# EAGLE board amyboard-v1.1dpwe (EAGLE 9.6.2)
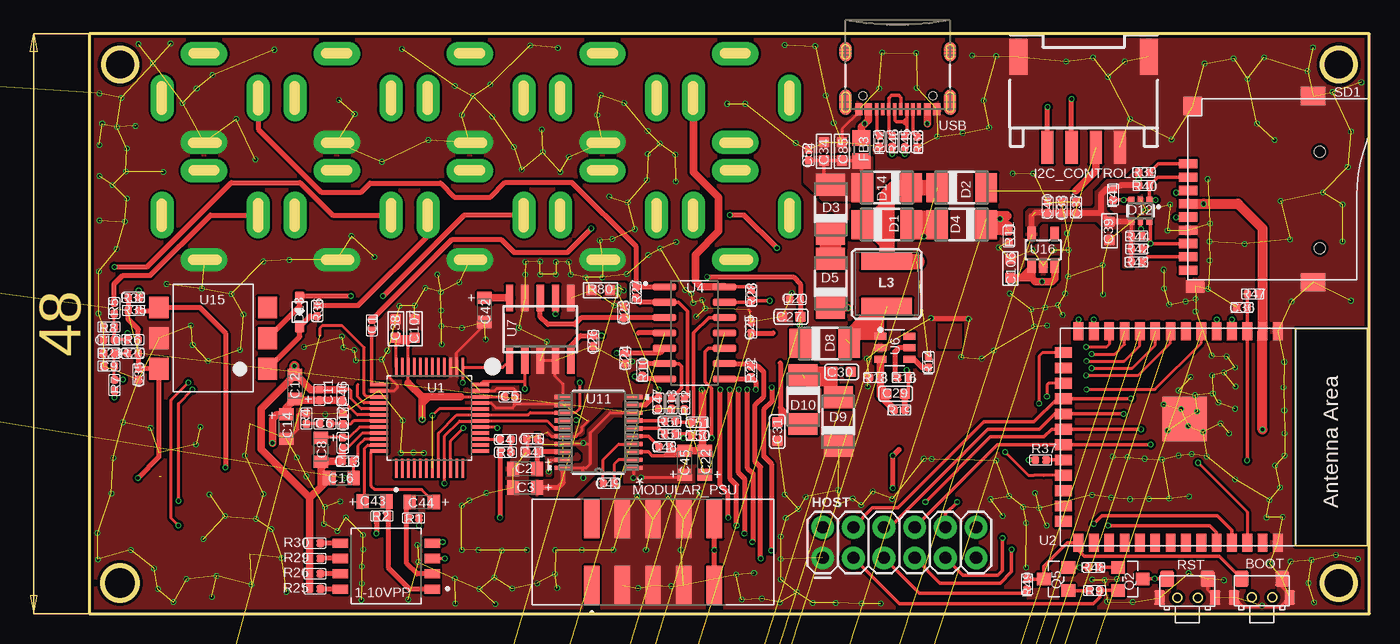
[diagram p2: board, top side]
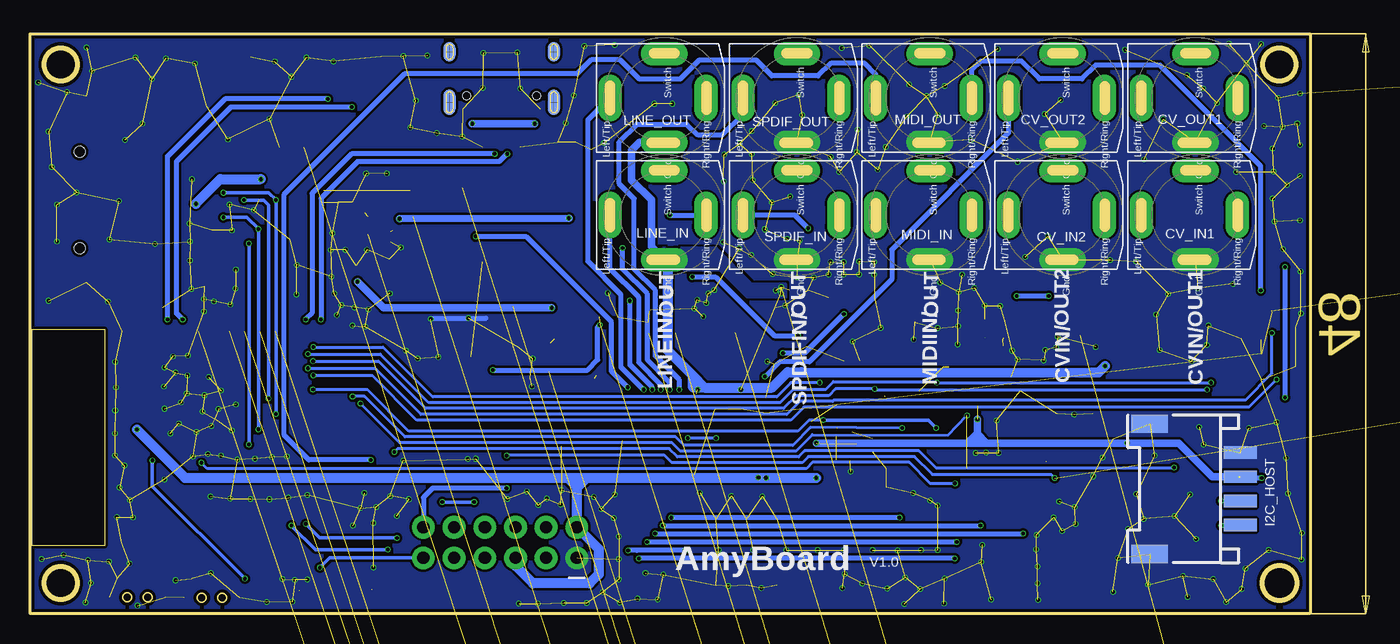
[diagram p3: board, bottom side, seen from below]

Size 106 x 48 mm. Coordinates in mm from the lower left corner, seen from the top.
Outline: 0,0 106,0 106,48 0,48 0,0
Outline: circle at 2.54,45.47 radius 1.37
Outline: circle at 2.54,2.54 radius 1.44
Outline: circle at 103.45,2.54 radius 1.37
Outline: circle at 103.45,45.47 radius 1.37
Copper layers (1*16): Top 0.035mm / dielectric 1.5mm / Bottom 0.035mm
Design rules "default": minimum track width 6mil, minimum drill 0.3mm, track to track 8mil, track to pad 8mil, pad to pad 8mil, via to via 8mil, smd to smd 0mil, copper to edge 10mil, drill to drill 8mil, minimum pad ring 3mil, minimum via ring 3mil, stop-mask expansion 4mil, vias tented up to drill 0mil, thermal gap 0mil
Net classes: 0 default: width 0.152 mm, drill 0.305 mm, clearance 0.152 mm

## Footprints (pad centres in the part's own frame; a part is rotated, then mirrored left to right if it is on the bottom)
SW_218-4LPSTR = smd 1.27 x 0.76: 1 -3.81,1.905; 2 -3.81,0.635; 3 -3.81,-0.635; 4 -3.81,-1.905; 5 3.81,-1.905; 6 3.81,-0.635; 7 3.81,0.635; 8 3.81,1.905
2*4*3.5MM = smd 1.15 x 1.3: 1 -1.675,0; 2 1.675,0 | smd 0.9 x 1.2: 3 2.3,1.55; 4 -2.3,1.55
DISCRETE_C0402 = smd 0.635 x 0.635: 1 -0.445,0; 2 0.445,0
SMC_Z = smd 1 x 1.2: + -1,0; - 1,0
C0603 = smd 0.889 x 0.889: 1 0,0.762; 2 0,-0.762
DISCRETE_C0603 = smd 0.889 x 0.889: 1 -0.762,0; 2 0.762,0
0603 = smd 0.889 x 0.889: 1 -0.762,0; 2 0.762,0
NV-PJ3410_SOCKET = drill 0.33 pad 1.93 long: GND 3.69,0; LEFT/TIP 0,-4.49; RIGHT/RING 0,3.459; SWITCH -3.674,0
DO-214AC = smd 1.8 x 2.4: A 2.025,0; C -2.025,0
SOT363 = smd 0.5 x 0.5: 1 -0.75,-0.9; 3 0.75,-0.9; 4 0.75,0.9; 6 -0.75,0.9 | smd 0.4 x 0.5: 2 0,-0.9; 5 0,0.9
SOD323 = smd 1 x 0.8: + -1.2,0; - 1.2,0
R0805 = smd 1.3 x 1.5: 1 -0.95,0; 2 0.95,0
2X6 = drill 1.016 pad 1.88: 1 0,0; 2 0,2.54; 3 2.54,0; 4 2.54,2.54; 5 5.08,0; 6 5.08,2.54; 7 7.62,0; 8 7.62,2.54; 9 10.16,0; 10 10.16,2.54; 11 12.7,0; 12 12.7,2.54
HW4-SMD-2.0-90D = smd 1.01 x 2.74: 1 -3,-0.1; 2 -1,-0.1; 3 1,-0.1; 4 3,-0.1 | smd 1.5 x 3: SS1 -5.4,7.4; SS2 5.4,7.4
CR54 = smd 4.2 x 1.4: P$1 0,1.85; P$2 0,-1.85
SOT25 = smd 0.55 x 1.2: 1 -0.95,-1.3; 2 0,-1.3; 3 0.95,-1.3; 4 0.95,1.3; 5 -0.95,1.3
SOT23-5 = smd 0.69 x 1.2: 1 -0.95,-1.3; 2 0,-1.3; 3 0.95,-1.3; 4 0.95,1.3; 5 -0.95,1.3
AMPHENOL_52601-G10-8LF = smd 1.27 x 3.18: 01 -5.08,-2.73; 02 -5.08,2.73; 03 -2.54,-2.73; 04 -2.54,2.73; 05 0,-2.73; 06 0,2.73; 07 2.54,-2.73; 08 2.54,2.73; 09 5.08,-2.73; 10 5.08,2.73
PW20_TEX = smd 1.473 x 0.356: 1 -2.921,2.925; 2 -2.921,2.275; 3 -2.921,1.625; 4 -2.921,0.975; 5 -2.921,0.325; 6 -2.921,-0.325; 7 -2.921,-0.975; 8 -2.921,-1.625; 9 -2.921,-2.275; 10 -2.921,-2.925; 11 2.921,-2.925; 12 2.921,-2.275; 13 2.921,-1.625; 14 2.921,-0.975; 15 2.921,-0.325; 16 2.921,0.325; 17 2.921,0.975; 18 2.921,1.625; 19 2.921,2.275; 20 2.921,2.925
SOT23 = smd 1.016 x 1.143: 1 -0.95,-1.016; 2 0.95,-1.016; 3 0,1.016
SOT23-3 = smd 0.8 x 0.9: 1 -0.95,-1; 2 0.95,-1; 3 0,1.1
DISCRETE_R0402 = smd 0.635 x 0.635: 1 -0.445,0; 2 0.445,0
DISCRETE_R0603 = smd 0.889 x 0.889: 1 -0.762,0; 2 0.762,0
9P-SMD-W/-RING = smd 1.524 x 0.762: 1 0,4.4; 2 0,3.3; 3 0,2.2; 4 0,1.1; 5 0,0; 6 0,-1.1; 7 0,-2.2; 8 0,-3.3; 9 0,-4.4 | smd 1.524 x 1.016: G1 0.6,-5.746 | smd 2.032 x 1.524: G2 10.373,-5.4; G3 10.373,10 | smd 1.524 x 1.524: G4 0.392,9.181 | hole 0.889: 10.9,-2.6; 10.9,5.4
SM77H = smd 1.6 x 1.5: 1 -2.55,-1.9; 2 2.55,-1.9; 3 2.55,1.9; 4 -2.55,1.9
QFP50P900X900X160-48N = smd 1.56 x 0.28: 1 -4.18,2.75; 2 -4.18,2.25; 3 -4.18,1.75; 4 -4.18,1.25; 5 -4.18,0.75; 6 -4.18,0.25; 7 -4.18,-0.25; 8 -4.18,-0.75; 9 -4.18,-1.25; 10 -4.18,-1.75; 11 -4.18,-2.25; 12 -4.18,-2.75; 25 4.18,-2.75; 26 4.18,-2.25; 27 4.18,-1.75; 28 4.18,-1.25; 29 4.18,-0.75; 30 4.18,-0.25; 31 4.18,0.25; 32 4.18,0.75; 33 4.18,1.25; 34 4.18,1.75; 35 4.18,2.25; 36 4.18,2.75 | smd 0.28 x 1.56: 13 -2.75,-4.18; 14 -2.25,-4.18; 15 -1.75,-4.18; 16 -1.25,-4.18; 17 -0.75,-4.18; 18 -0.25,-4.18; 19 0.25,-4.18; 20 0.75,-4.18; 21 1.25,-4.18; 22 1.75,-4.18; 23 2.25,-4.18; 24 2.75,-4.18; 37 2.75,4.18; 38 2.25,4.18; 39 1.75,4.18; 40 1.25,4.18; 41 0.75,4.18; 42 0.25,4.18; 43 -0.25,4.18; 44 -0.75,4.18; 45 -1.25,4.18; 46 -1.75,4.18; 47 -2.25,4.18; 48 -2.75,4.18
ESP32-­S2-­SOLO = smd 1.5 x 0.9: 1 -8.75,5.26; 2 -8.75,3.99; 3 -8.75,2.72; 4 -8.75,1.45; 5 -8.75,0.18; 6 -8.75,-1.09; 7 -8.75,-2.36; 8 -8.75,-3.63; 9 -8.75,-4.9; 10 -8.75,-6.17; 11 -8.75,-7.44; 12 -8.75,-8.71; 13 -8.75,-9.98; 14 -8.75,-11.25; 27 8.75,-11.25; 28 8.75,-9.98; 29 8.75,-8.71; 30 8.75,-7.44; 31 8.75,-6.17; 32 8.75,-4.9; 33 8.75,-3.63; 34 8.75,-2.36; 35 8.75,-1.09; 36 8.75,0.18; 37 8.75,1.45; 38 8.75,2.72; 39 8.75,3.99; 40 8.75,5.26 | smd 0.9 x 1.5: 15 -6.985,-12.5; 16 -5.715,-12.5; 17 -4.445,-12.5; 18 -3.175,-12.5; 19 -1.905,-12.5; 20 -0.635,-12.5; 21 0.635,-12.5; 22 1.905,-12.5; 23 3.175,-12.5; 24 4.445,-12.5; 25 5.715,-12.5; 26 6.985,-12.5 | smd 3.7 x 3.7: 41 -1.5,-2.46
SOIC127P600X175-14N = smd 1.97 x 0.6: 1 -2.475,3.81; 2 -2.475,2.54; 3 -2.475,1.27; 4 -2.475,0; 5 -2.475,-1.27; 6 -2.475,-2.54; 7 -2.475,-3.81; 8 2.475,-3.81; 9 2.475,-2.54; 10 2.475,-1.27; 11 2.475,0; 12 2.475,1.27; 13 2.475,2.54; 14 2.475,3.81
SOP50P490X110-10N = smd 1.47 x 0.28: 1 -2.15,1; 2 -2.15,0.5; 3 -2.15,0; 4 -2.15,-0.5; 5 -2.15,-1; 6 2.15,-1; 7 2.15,-0.5; 8 2.15,0; 9 2.15,0.5; 10 2.15,1
SOT-23-6 = smd 1 x 0.6: 1 -1.2,0.95; 2 -1.2,0; 3 -1.2,-0.95; 4 1.2,-0.95; 5 1.2,0; 6 1.2,0.95
SOIC-10 = smd 0.6 x 2.2: 1 -2.54,-2.6; 2 -1.27,-2.6; 3 0,-2.6; 4 1.27,-2.6; 5 2.54,-2.6; 6 2.54,2.6; 7 1.27,2.6; 8 0,2.6; 9 -1.27,2.6; 10 -2.54,2.6
SOP-6-2.54MM = smd 1.6 x 1.8: 1 -4.5,2.54; 2 -4.5,0; 3 -4.5,-2.54; 4 4.5,-2.54; 5 4.5,0; 6 4.5,2.54
USB-C-16P-5 = smd 0.3 x 1: A5 -1.25,-0.34; A6 -0.25,-0.34; A7 0.25,-0.34; A8 1.25,-0.34; B5 1.75,-0.34; B6 0.75,-0.34; B7 -0.75,-0.34; B8 -1.75,-0.34 | smd 0.6 x 1: GND -3.225,-0.34; GND2 3.225,-0.34; VBUS1 -2.45,-0.34; VBUS2 2.45,-0.34 | smd 1 x 2.1: SHLD1 -4.32,-0.915; SHLD2 4.32,-0.915 | smd 1 x 2.1 bottom: SHLD3 -4.32,-0.915; SHLD4 4.32,-0.915 | smd 1 x 1.6: SHLD5 -4.32,-5.095; SHLD8 4.32,-5.095 | smd 1 x 1.6 bottom: SHLD6 -4.32,-5.095; SHLD7 4.32,-5.095 | hole 0.65: -2.89,-1.445; 2.89,-1.445

## Placement (x,y rotation side)
1-10VPP  218-4LPSTR  [SW_218-4LPSTR]  24.59,3.94 180 top
BOOT  TS24CA  [2*4*3.5MM]  97.1,2.9 180 top
C1  100nF  [DISCRETE_C0402]  23.39,23.88 90 top
C2  10uF/10V/TAN  [SMC_Z]  36.09,11.99 180 top
C3  10uF/10V/TAN  [SMC_Z]  36.09,10.46 180 top
C4  100nF  [DISCRETE_C0402]  34.47,14.43 0 top
C5  100nF  [DISCRETE_C0402]  34.82,17.96 0 top
C6  68nF  [DISCRETE_C0402]  19.51,15.72 0 top
C7  100nF  [DISCRETE_C0402]  20.98,14.15 270 top
C8  10uF/10V/TAN  [SMC_Z]  19.18,13.56 270 top
C9  1nF  [DISCRETE_C0402]  1.63,20.5 180 top
C10  1nF  [DISCRETE_C0402]  1.63,22.68 180 top
C11  100nF  [DISCRETE_C0402]  19.05,18.11 90 top
C12  10uF/10V/TAN  [SMC_Z]  17.04,18.77 90 top
C13  100nF  [DISCRETE_C0402]  21.39,12.62 180 top
C14  10uF/10V/TAN  [SMC_Z]  16.31,15.49 270 top
C15  100nF  [DISCRETE_C0402]  36.68,14.48 180 top
C16  10uF/10V/TAN  [SMC_Z]  20.88,11.23 180 top
C17  4.7nF  [DISCRETE_C0402]  21.01,16.15 270 top
C20  100nF  [DISCRETE_C0402]  58.45,26.01 0 top
C21  1uF  [DISCRETE_C0402]  -292.89,-1094.18 0 top  (outside the outline)
C22  10uF/10V/TAN  [SMC_Z]  50.98,12.5 90 top
C23  100nF  [DISCRETE_C0402]  44.25,24.94 270 top
C24  100nF  [DISCRETE_C0402]  44.37,21.13 90 top
C25  100nF  [DISCRETE_C0402]  54.81,23.67 90 top
C26  100nF  [DISCRETE_C0402]  41.73,22.58 90 top
C27  22uF  [C0603]  58.12,24.59 270 top
C28  10uF  [DISCRETE_C0402]  -292.89,-1091.62 0 top  (outside the outline)
C29  22pF  [C0603]  66.78,18.21 270 top
C30  1uF  [C0603]  62.31,20.02 270 top
C31  10uF  [C0603]  56.97,15.09 180 top
C32  1uF  [DISCRETE_C0402]  -292.89,-1107.74 0 top  (outside the outline)
C33  100nF  [DISCRETE_C0402]  80.52,33.63 270 top
C34  10uF  [DISCRETE_C0603]  60.83,38.28 270 top
C35  100nF  [DISCRETE_C0402]  4.06,19.81 270 top
C36  100nF  [DISCRETE_C0402]  95.45,25.35 0 top
C37  100nF  [DISCRETE_C0402]  81.71,33.63 270 top
C38  10uF  [DISCRETE_C0603]  25.37,23.6 90 top
C39  10uF  [DISCRETE_C0603]  84.48,31.7 90 top
C40  100nF  [DISCRETE_C0402]  79.35,33.63 90 top
C41  100nF  [DISCRETE_C0402]  36.65,13.39 0 top
C42  10uF/10V/TAN  [SMC_Z]  32.72,25.15 270 top
C43  10uF/10V/TAN  [SMC_Z]  23.62,9.27 0 top
C44  10uF/10V/TAN  [SMC_Z]  27.53,9.25 180 top
C45  10uF/10V/TAN  [SMC_Z]  49.3,12.5 90 top
C46  100nF  [DISCRETE_C0402]  20.98,18.11 90 top
C47  100nF  [DISCRETE_C0402]  47.14,17.4 90 top
C48  2.2uF  [DISCRETE_C0402]  47.62,13.82 180 top
C49  2.2uF  [DISCRETE_C0402]  43,10.79 180 top
C50  2.2nF  [DISCRETE_C0402]  50.34,14.76 180 top
C51  2.2nF  [DISCRETE_C0402]  50.34,15.85 180 top
C52  100nF  [DISCRETE_C0402]  59.56,37.97 270 top
C53  1uF  [DISCRETE_C0402]  -292.89,-1113.64 0 top  (outside the outline)
C54  1uF  [DISCRETE_C0402]  -292.89,62.23 0 top  (outside the outline)
C55  1uF  [DISCRETE_C0402]  -292.89,64.8 0 top  (outside the outline)
C56  10uF  [C0603]  -299.9,-1121.79 0 top  (outside the outline)
C85  10uF  [DISCRETE_C0603]  62.33,38.28 270 top
C106  4.7uF/16V  [0603]  76.28,28.57 90 top
C107  10uF  [0603]  26.92,23.6 90 top
CV_IN1  NV-PJ3410_STEREO  [NV-PJ3410_SOCKET]  9.5,33 270 bottom
CV_IN2  NV-PJ3410_STEREO  [NV-PJ3410_SOCKET]  20.5,33 270 bottom
CV_OUT1  NV-PJ3410_STEREO  [NV-PJ3410_SOCKET]  9.5,42.7 270 bottom
CV_OUT2  NV-PJ3410_STEREO  [NV-PJ3410_SOCKET]  20.5,42.7 270 bottom
D1  SS34  [DO-214AC]  66.04,32.21 0 top
D2  SS34  [DO-214AC]  72.24,35.28 0 top
D3  SS34  [DO-214AC]  61.39,33.48 90 top
D4  SS34  [DO-214AC]  72.24,32.21 180 top
D5  SS34  [DO-214AC]  61.39,27.36 90 top
D8  SS34  [DO-214AC]  60.91,22.38 0 top
D9  SS34  [DO-214AC]  62.03,15.9 90 top
D10  SS34  [DO-214AC]  59.11,17.73 270 top
D12  SMF05C  [SOT363]  87.05,33.35 180 top
D13  1N4148WS  [SOD323]  17.42,24.97 270 top
D14  SS34  [DO-214AC]  66.04,35.28 180 top
FB3  100Mhz@120R  [R0805]  63.96,38.43 270 top
HOST  2X6 FEMALE  [2X6]  60.73,4.62 0 top
I2C_CONTROL  HW4-SMD-2.0  [HW4-SMD-2.0-90D]  82.35,38.71 0 top
I2C_HOST  HW4-SMD-2.0  [HW4-SMD-2.0-90D]  5.89,10.34 90 bottom
L3  3.3µH/±30%/3.4A  [CR54]  66.04,27.3 0 top
LDK320AM120R  TS5205  [SOT25]  -292.25,-1080.24 0 top  (outside the outline)
LINE_IN  NV-PJ3410_STEREO  [NV-PJ3410_SOCKET]  53.5,33 270 bottom
LINE_OUT  NV-PJ3410_STEREO  [NV-PJ3410_SOCKET]  53.5,42.7 270 bottom
ME6214C33  SPX3819  [SOT23-5]  -291.82,-1122.53 0 top  (outside the outline)
ME6214C50  SPX3819  [SOT23-5]  -291.82,-1117.22 0 top  (outside the outline)
MIDI_IN  NV-PJ3410_STEREO  [NV-PJ3410_SOCKET]  31.5,33 270 bottom
MIDI_OUT  NV-PJ3410_STEREO  [NV-PJ3410_SOCKET]  31.5,42.7 270 bottom
MODULAR_PSU  52601-G10-8LF  [AMPHENOL_52601-G10-8LF]  46.69,5.11 0 top
PCM5101  U11  [PW20_TEX]  42.16,15.01 180 top
Q2  S8050  [SOT23]  86.21,2.87 270 top
Q3  AO3407  [SOT23-3]  -296.19,-1123.7 0 top  (outside the outline)
Q5  S8050  [SOT23]  80.06,2.87 90 top
R1  5.1K  [DISCRETE_R0402]  26.85,7.92 0 top
R2  5.1K  [DISCRETE_R0402]  24.23,8.08 180 top
R3  150R  [DISCRETE_R0402]  34.47,13.36 180 top
R4  680R  [DISCRETE_R0402]  17.98,16.15 90 top
R5  39.7K  [DISCRETE_R0402]  2.06,25.3 90 top
R6  13.1K  [DISCRETE_R0402]  3.61,22.68 0 top
R7  39.7K  [DISCRETE_R0402]  2.08,18.92 270 top
R8  10K  [DISCRETE_R0402]  1.63,23.72 0 top
R9  10K  [DISCRETE_R0402]  83.24,1.93 0 top
R10  30K  [DISCRETE_R0402]  45.8,20.14 90 top
R11  100K  [DISCRETE_R0402]  76.15,31.22 90 top
R12  10K  [DISCRETE_R0402]  49.28,17.37 270 top
R13  10K  [DISCRETE_R0402]  48.21,17.4 270 top
R14  10K  [DISCRETE_R0402]  69.49,20.83 270 top
R15  10R  [DISCRETE_R0402]  -292.89,-1085.72 0 top  (outside the outline)
R16  0R  [DISCRETE_R0402]  67.39,19.56 180 top
R17  10R  [DISCRETE_R0402]  -292.89,-1104.42 0 top  (outside the outline)
R18  4.65K  [DISCRETE_R0402]  65.05,19.56 180 top
R19  100K  [DISCRETE_R0402]  67.11,16.87 180 top
R20  13.1K  [DISCRETE_R0402]  3.61,21.56 0 top
R21  10K  [DISCRETE_R0402]  1.63,21.56 0 top
R22  51K  [DISCRETE_R0402]  54.79,20.04 90 top
R23  1K  [DISCRETE_R0402]  -292.89,-1110.31 0 top  (outside the outline)
R24  2R  [DISCRETE_R0402]  -284.12,-1074.72 0 top  (outside the outline)
R25  2.2K  [DISCRETE_R0402]  18.69,2.06 0 top
R26  2.2K  [DISCRETE_R0402]  18.69,3.3 0 top
R27  30K  [DISCRETE_R0402]  45.26,26.59 270 top
R28  51K  [DISCRETE_R0402]  54.81,26.37 270 top
R29  22K  [DISCRETE_R0402]  18.69,4.57 0 top
R30  22K  [DISCRETE_R0402]  18.69,5.84 0 top
R31  10K  [DISCRETE_R0402]  -304.47,-1134.06 0 top  (outside the outline)
R32  10K  [DISCRETE_R0402]  -304.47,-1137.39 0 top  (outside the outline)
R33  10K  [DISCRETE_R0402]  -304.47,-1147.57 0 top  (outside the outline)
R35  470R  [DISCRETE_R0402]  3.66,25.1 0 top
R36  220R  [DISCRETE_R0402]  18.87,25.07 270 top
R37  10R  [DISCRETE_R0402]  78.79,12.73 0 top
R38  33R  [DISCRETE_R0402]  3.66,26.19 180 top
R39  10K  [DISCRETE_R0402]  87.35,36.53 180 top
R40  10K  [DISCRETE_R0402]  87.35,35.46 180 top
R41  10K  [DISCRETE_R0402]  84.79,34.7 90 top
R42  10K  [DISCRETE_R0402]  86.74,30.2 180 top
R43  10K  [DISCRETE_R0402]  86.74,29.11 180 top
R44  NC  [DISCRETE_R0402]  86.74,31.27 180 top
R45  51R  [DISCRETE_R0402]  67.54,39.07 270 top
R46  51R  [DISCRETE_R0402]  66.5,39.09 270 top
R47  10K  [DISCRETE_R0402]  96.34,26.47 0 top
R48  10K  [DISCRETE_R0402]  83.19,3.84 180 top
R49  10K  [DISCRETE_R0402]  77.67,2.44 270 top
R50  470R  [DISCRETE_R0402]  48.08,15.93 180 top
R51  470R  [DISCRETE_R0402]  48.08,14.88 180 top
R52  5.1K  [DISCRETE_R0402]  65.43,39.12 270 top
R53  5.1K  [DISCRETE_R0402]  68.55,39.04 270 top
R80  0R  [DISCRETE_R0603]  42.34,26.77 180 top
RST  TS24CA  [2*4*3.5MM]  90.93,2.88 180 top
SD1  SD  [9P-SMD-W/-RING]  90.98,32.84 0 top
SPDIF_IN  NV-PJ3410_STEREO  [NV-PJ3410_SOCKET]  42.5,33 270 bottom
SPDIF_OUT  NV-PJ3410_STEREO  [NV-PJ3410_SOCKET]  42.5,42.7 270 bottom
TXC7W-22.5792MBE  SM77H  [SM77H]  -295.27,-1129.46 0 top  (outside the outline)
U1  PCM9211PT  [QFP50P900X900X160-48N]  28.17,16.21 90 top
U2  ESP32­S2­SOLO  [ESP32-­S2-­SOLO]  93.17,14.63 270 top
U4  TL074CD  [SOIC127P600X175-14N]  50.11,23.24 0 top
U5  ADS1015IDGSR  [SOP50P490X110-10N]  -302.56,-1142.64 0 top  (outside the outline)
U6  HX3608  [SOT-23-6]  66.7,22.02 0 top
U7  GP8413  [SOIC-10]  37.34,23.55 0 top
U15  H11L1SR2M  [SOP-6-2.54MM]  10.26,22.81 180 top
U16  SPX3819  [SOT23-5]  78.99,30.12 0 top
USB  USB-C  [USB-C-16P-5]  66.95,41.43 180 top
XC6901DC01MR-G  TS5205  [SOT25]  -292.25,-1098.93 0 top  (outside the outline)

## Tracks (layer width: path | path; a pad name or v marks a point on that pad's centre or on a via)
3V3_IN  (2 unrouted)
  Top 0.305: D2.A 74.53,35.01 | 83.34,38.6 I2C_CONTROL.3
  Top 0.635: 81.69,35.01 83.34,36.65 83.34,38.6
5V_IN
  Top 0.305: C34.2 C85.2 62.37,37.48 FB3.2 63.96,35.34 D14.A | C34.2 60.83,36.06 D3.A | C52.2 C34.2
  pour Top: 59.28,37.82 64.77,37.82 64.77,34.21 60.76,34.21 59.46,35.51 59.28,35.69
12_IN  (via drill 0.3)
  Top 0.406: D1.A 68.58,32.21 | 68.58,32.21 D4.A | MODULAR_PSU.09 v51.77,5.26 MODULAR_PSU.10 | v56.52,18.75 56.52,17.55 55.83,16.87 55.83,13.06 56.49,12.39 v56.49,5.23 | 68.1,31.22 69.14,31.22 | 69.62,31.67 69.62,31.22 69.14,31.22 | 69.14,31.22 v69.11,31.24 | 68.61,31.67 68.61,32.18 68.58,32.21
  Top 0.813: 69.62,31.67 68.61,31.67 | D1.A 68.83,32.97 69.77,32.97 69.22,32.41 68.58,32.41
  Bottom 0.406: v51.77,5.26 55.75,5.23 v56.49,5.23 | v56.52,18.75 57.86,20.09 57.86,24.16 64.95,31.24 v69.11,31.24
12V5_UNREG  (7 unrouted)
13.5V  (via drill 0.3)  (3 unrouted)
  Top 0.254: 58.88,23.96 58.88,23.97
  Top 0.305: 67.55,18.2 C29.1 67.83,18.5 R16.1 | 67.54,16.85 R19.1 | 67.65,17.78 67.55,17.68 | 58.9,26.02 C20.2 | C27.1
  Top 0.406: D8.C 58.88,23.96 | C27.1 C20.2 58.89,27.29 58.29,27.89 v51.16,27.89 | 58.88,23.97 C27.1 | U7.5 39.88,22.2 40.69,23.01 41.72,23.01 C26.2 42.41,23.02 v42.42,23.01 | R16.1 67.83,20.03 v67.69,20.17
  Top 0.508: R19.1 67.55,17.68 67.55,18.2
  Bottom 0.406: v51.16,27.89 49.25,27.89 44.37,23.01 v42.42,23.01 | v67.69,20.17 59.84,20.17 59,21.01 59,23.75 58.83,23.93
  other vias: 58.83,23.9
+3V3  (via drill 0.3)  (16 unrouted)
  Top 0.254: C46.1 22.19,16.45 U1.42 | U1.36 25.42,22.79 C38.1 | C5.1 U1.22 30.73,17.96 | 37.56,14.04 C15.1 | PCM5101.20 40.89,12.09 | 40.89,12.09 41.17,12.09 41.5,12.42 41.5,13.87 | 41.5,13.87 41.35,14.02 39.26,14.02 | 41.5,13.87 41.5,14.99 43.16,16.64 45.08,16.64 | v40.89,11.25 40.89,12.09 | 26.92,22.86 26.42,22.36 U1.34 26.42,19.1 | C107.1 25.35,22.84 25.3,22.89 | 26.42,22.07 26.42,22.2 26.21,22.4 25.65,22.4 25.43,22.17 | PCM5101.1 45.06,12.09 v45.06,11.25 45.7,11.25 v45.7,11.28 49.3,11.28 C45.+
  Top 0.305: D12.4 R44.2 R42.2 R43.2 | C39.2 | 83.77,33.2 83.76,33.19 | HOST.5 68.76,1.68 77.37,1.68 77.7,2.01 | U2.2
  Top 0.406: C107.1 C38.1 | C3.+ 38.86,10.46 39.24,10.85 PCM5101.20 | R38.2 3.21,24.96 3.17,24.92 | 4.05,21.45 C35.1 4.08,20.27 U15.6 5.76,12.97 v4.01,11.23 | 4.05,21.49 4.05,21.45 | 4.05,21.45 4.01,21.41
  Top 0.508: D12.4 C39.2 | R39.2 v86.91,35.97 R40.2 85.43,35.46 R41.2 84.24,35.14 83.77,34.67 83.77,33.2 | U16.5 78.04,32.9 | 78.31,33.19 C40.1 C33.2 C37.2 83.76,33.19 C39.2 | U2.2 97.16,26.1 R47.2
  Top 0.61: C46.1 C11.1 17.15,17.67 C12.+ 16.31,17.03 C14.+ 16.3,16.48 15.49,16.48 15.16,16.15 v15.16,14.12 | 27.56,17.95 v27.56,16.08 | 27.56,17.95 29.79,17.95 29.79,17.96 30.73,17.96 | 27.56,17.95 26.42,19.1 | 25.45,22.73 25.48,22.71 26.62,22.71 | 27.56,17.2 27.56,17.42 28.09,17.96
  Top 0.813: v97.16,15.24 U2.2 | U2.2 97.16,31.9 95.11,33.94 SD1.4 92.28,33.94 v92.28,33.93
  Bottom 0.406: v4.01,11.23 5.82,11.23 5.94,11.35
  Bottom 0.61: I2C_HOST.3 8.09,11.34 10.87,14.12 v15.16,14.12 26.8,14.12 | v40.89,14.12 28.37,14.12 | 28.37,14.12 27.61,14.12 | 27.61,14.12 26.8,14.12 | v27.56,16.08 27.56,14.88 | 27.56,14.88 27.56,14.17 27.61,14.12 | 26.8,14.12 27.56,14.88 | 27.56,14.88 27.61,14.88 28.37,14.12
  Bottom 0.813: v40.89,11.25 v45.06,11.25 59.89,11.25 | v92.28,33.93 90.25,35.97 v86.91,35.97 | v97.16,15.24 93.17,11.25 61.52,11.25 | 61.52,11.25 60.66,11.25 | 60.66,11.25 59.89,11.25 | 60.73,10.41 HOST.2 58.93,5.36 58.93,3.25 59.66,2.52 64.36,2.52 65.81,3.96 HOST.5 | 60.73,10.46 60.73,11.18 60.66,11.25 | 59.89,11.25 60.73,10.41 | 60.73,10.41 60.73,10.46 | 60.73,10.46 61.52,11.25
  pour Top: 44.35,12.24 51.54,12.24 51.54,10.87 44.37,10.87 44.35,10.87
  pour Top: 36.63,9.86 40.13,9.86 41.99,11.71 41.99,14.91 43.46,16.38 45.29,16.38 45.29,16.76 42.85,16.76 41.3,15.21 41.3,14.71 40.94,14.35 37.74,14.35 37.29,14.81 36.88,14.81 36.88,14 40.28,14 40.97,13.31 40.97,12.62 40.67,12.32 38.61,12.32 38.61,11.25 38.35,11 36.6,11 36.6,9.88
  pour Top: 86.51,28.7 86.51,32.84 84.71,32.84 84.15,33.4 84.15,34.72 84.35,34.92 86.82,34.92 87.1,35.2 87.1,36.75 86.72,36.75 85.8,35.84 84.28,35.84 83.34,34.9 83.34,33.71 83.08,33.45 77.83,33.45 77.6,33.22 77.6,30.81 78.44,30.81 78.44,32.18 78.82,32.56 83.39,32.56 84,31.95 85.24,31.95 85.65,31.55 85.65,28.7
-12.6V  (1 unrouted)
  Top 0.406: C25.1 56.64,23.23
A3V3  (10 unrouted)
  Top 0.406: R6.2 4.05,23.53 3.2,24.38 3.2,25.08 | 4.06,21.55 R20.2
A5V  (via drill 0.3)  (3 unrouted)
  Top 0.254: U1.46 22.79,14.46 22.23,13.89 22.23,12.95 21.84,12.57 | C13.1 21.83,11.27 C16.+ v21.16,11.23
  Top 0.406: 67.07,13.6 v66.55,13.08 v66.55,10.39
  Bottom 0.254: v66.55,13.08 66.52,13.11 53.47,13.11 52.86,12.5 42.06,12.5 41.55,13.01 32.77,13.01 31.29,11.53 21.46,11.53 v21.16,11.23
  Bottom 0.406: v66.55,10.39 72.67,10.39 73.43,9.63 HOST.12
A12V  (2 unrouted)
  Top 0.406: U4.4 45.45,23.24
A-12V  (2 unrouted)
ADC1  (via drill 0.3)  (1 unrouted)
  Top 0.254: 2.07,23.22 C10.1 R6.1 3.17,22.7 v3.17,23.24 | 2.07,23.22 R8.2 | R8.2 2.06,23.74 R5.1 | 2.1,23.24 2.07,23.22 | 2.25,23.55 R8.2 | v83.01,20.32 86.36,20.32 88.27,22.23 88.27,23.38
  Bottom 0.254: v3.17,23.24 3.17,19.89 5.38,17.68 39.45,17.68 39.55,17.58 42.27,17.58 43.33,16.51 73.64,16.51 77.44,20.32 v83.01,20.32
ADC2  (via drill 0.3)  (1 unrouted)
  Top 0.254: R20.1 R21.2 C9.1 R7.1 2.1,19.38 v2.79,19.38 | v82.55,19.74 86.87,19.74 89.53,22.4 89.53,23.38
  Bottom 0.254: v2.79,19.38 5.08,17.09 41.94,17.09 43,16.03 73.99,16.03 77.7,19.74 v82.55,19.74
AGND  (via drill 0.3)  (7 unrouted)
  Top 0.254: U1.45 22.6,14.96 21.35,13.7 C7.2 | U1.41 22.52,16.95 21.67,17.8 21.67,18.47 21.57,18.57 20.99,18.57 C46.2 | 19.17,12.57 C8.- | 50.8,18.21 50.8,18.24 50.62,18.41 50.62,18.64 50.77,18.64 50.95,18.47 50.95,18.01
  Top 0.305: PCM5101.3 46.3,13.39 46.61,13.08 47.6,13.08 | 47.6,13.08 48.18,13.08 | 48.18,13.08 48.89,13.08 C45.- | C48.1 48.07,13.2 48.18,13.08 | 48.26,13.46 47.98,13.46 47.6,13.08
  Top 0.406: 50.79,18.33 50.79,18.48 v50.72,18.54 | PCM5101.9 46.06,17.29 46.61,17.83 C47.2 v47.14,18.54
  Top 0.61: 50.79,18.33 C51.1 C50.1 50.79,13.69 C22.- C45.- | 49.23,13.46 48.26,13.46 | C46.2 C11.2 18.33,18.55 17.11,19.77 C12.- 14.25,16.98 14.25,13.6 18.25,9.6 | R25.1 R26.1 R29.1 R30.1 18.25,9.6 | 18.25,9.6 19.18,10.53 | 19.18,10.53 C16.- | C8.- 19.18,12.06 | 19.18,12.06 19.18,10.53 | 19.18,12.06 19.74,12.62 C13.2 20.94,13.66 C7.2
  Top 0.813: 17.11,19.77 16.99,19.89 v16.99,20.5
  Bottom 0.254: 51.1,18.72 50.9,18.72 v50.72,18.54 | 44.55,18.72 44.73,18.54 v47.14,18.54
  Bottom 0.61: LINE_IN.GND 54.56,30.37 54.56,34.27 56.19,35.89 56.19,38.38 55.55,39.01 LINE_OUT.GND
  Bottom 0.813: LINE_IN.GND 53.21,29.02 53.21,21.79 51.1,19.68 | 51.1,19.68 50.14,18.72 | 50.14,18.72 44.55,18.72 43.28,19.99 42.14,19.99 18.09,19.96 17.52,19.96 v16.99,20.5 | 50.14,18.72 51.1,18.72 51.1,19.68
  Bottom 1.27: 53.45,29.26 LINE_IN.GND
  other vias: 43.81,27.03 43.81,26.52 44.25,26.77
  pour Top: 42.67,27.3 44.35,27.3 44.35,26.19 42.67,26.19
  pour Bottom: 54.08,30.28 49.23,30.28 46.25,27.3 43.43,27.3 43.43,26.19 46.63,26.19 48.87,28.42 53.9,28.42 54.08,28.42
AMY_FOLLOWER_SCL  (via drill 0.3)
  Top 0.406: v93.37,24.36 93.37,23.4 U2.5 | I2C_CONTROL.1 v79.35,41.93 v79.35,41.94
  Bottom 0.406: v79.35,41.94 89.38,41.94 93.88,37.44 93.88,24.87 v93.37,24.36
AMY_FOLLOWER_SDA  (via drill 0.3)
  Top 0.305: I2C_CONTROL.2
  Top 0.406: U2.4 v94.62,24.36 v94.61,24.36 | I2C_CONTROL.2 81.35,42.61 v81.36,42.62
  Bottom 0.406: v81.36,42.62 89.86,42.62 94.61,37.87 v94.61,24.36
AMYIN  (via drill 0.3)
  Top 0.254: U2.17 79.43,19.07 79.3,18.95 v79.3,17.98 | U1.17 32.36,15.47 33.68,15.47 v33.78,15.37
  Bottom 0.254: v33.78,15.37 41.38,15.42 42.85,13.95 51.87,13.95 52.55,14.63 74.95,14.63 78.31,17.98 v79.3,17.98
AMYOUT  (via drill 0.3)  (1 unrouted)
  Top 0.254: v40.31,16.03 39.28,16.03 PCM5101.14 | U1.10 29.92,14.32 v30.96,15.37 | v82.58,18.57 88.24,18.57 92.08,22.4 U2.6
  Bottom 0.254: v40.31,16.03 41.5,16.03 42.42,15.11 74.65,15.11 78.11,18.57 v82.58,18.57
  Bottom 0.305: v40.31,16.03 31.62,16.03 v30.96,15.37
BCLK  (via drill 0.3)
  Top 0.254: U1.19 | U1.19 36.34,16.45 36.52,16.64 PCM5101.13 40.28,16.64 40.62,16.97 v40.62,19.13 | U1.8 28.92,14.95 30.43,16.45 U1.19 | U2.12 84.46,22.3 84.23,22.07 v82.55,22.07
  Bottom 0.254: v82.55,22.07 76.78,22.07 72.67,17.96 44.17,17.96 43,19.13 v40.62,19.13
CV_OUT1
  Top 0.406: CV_OUT1.LEFT/TIP 13.99,40.11 19.2,34.9 22.5,34.9 23.24,35.64 29.08,35.64 30.23,34.49 33.22,34.49 34.44,35.71 39.95,35.71 45.26,30.4 R27.1 47.63,27.04 U4.1
CV_OUT2  (via drill 0.3)
  Top 0.406: U4.7 45.8,19.43 | 45.8,19.43 45.36,19.43 v45.16,19.63 | R10.1 45.8,19.43
  Bottom 0.406: CV_OUT2.LEFT/TIP 24.99,39.8 34.65,30.15 34.65,27.69 41.48,20.85 43.94,20.85 v45.16,19.63
DTR  (via drill 0.3)
  Top 0.305: Q5.2 v82.02,3.82 | v82.02,3.82 82.72,3.82 R48.2 | v82.02,3.81 v82.02,3.82
  Bottom 0.305: HOST.11 81.2,4.62 v82.02,3.81
ENABLE
  Top 0.406: R14.2 68.95,20.38 68.28,21.06 67.92,21.06 U6.4
GND  (via drill 0.3)  (461 unrouted)
  Top 0.203: 95.59,0.53 98.6,0.51
  Top 0.254: USB.GND2 63.73,41.53 62.33,40.13 C85.1 | U1.21 33.27,17.45 33.68,17.04 35.05,17.04 35.2,17.2 | 35.2,17.2 35.2,17.96 35.23,17.98 35.2,17.98 | 39.21,17.32 PCM5101.12 | 39.21,17.32 39.21,17.9 PCM5101.11 39.24,19 38.58,19.66 38.58,20.92 U7.4 U7.3 | BOOT.3 95.59,0.53 | 98.6,0.51 99.36,1.45 99.52,1.45 99.54,1.42 99.57,1.42 98.81,2.18 98.81,2.95 | RST.4 92.61,1.96 RST.1 | U1.26 30.4,20.4 30.4,21.59 32.69,23.88 32.69,24.18 32.72,24.18 | C15.2 36.23,13.41 C41.1 | 54.61,25.15 54.71,25.02 | U1.23 33.57,18.45 33.76,18.64 35.13,18.64 35.26,18.52 35.26,17.97 C5.2 | U1.38 25.24,18.45 25.53,18.75 25.53,18.87 24.79,19.61 | 39.21,17.32 35.33,17.32 35.2,17.2 | PCM5101.16 40.31,14.69 40.79,15.16 40.79,15.44 41.3,15.95 | 38.12,12.68 38.18,12.72 39.24,12.72 | 37.95,15.01 38.28,14.68 39.22,14.68 | C14.- 16.53,14.49 17.27,15.24 17.27,16.46 17.35,16.54 17.92,16.54 R4.2
  Top 0.406: v69.7,24.46 72.8,24.46 72.85,24.41 72.87,24.41 72.9,24.38
  Bottom 0.406: v69.7,24.46 68.28,24.46 68.25,24.43 72.8,24.43 v72.82,24.41
  other vias: 97.1,0.66 50.27,24.59 49.35,26.8 50.01,25.73 50.77,25.98 51,25.27 83.03,9.83 93.7,15.75 90.2,13.08 88.95,17.32 94.87,16.97 92.53,13.03 93.5,17.48 84.63,9.6 94.92,18.8 93.04,18.24 85.98,12.95 91.29,13.21 89.31,15.16 86.18,9.47 94.87,20.4 92.99,19.74 87.4,12.83 91.06,9.7 89.43,9.53 93.95,19.96 87.76,9.5 94.18,21.31 92.94,21.36 88.85,12.75 22.07,20.98 21.95,21.82 21.06,22.05 20.9,22.94 9.45,6.17 11.23,8.08 8.03,2.87 13.79,7.85 15.09,7.01 15.93,4.62 13.41,2.41 10.13,1.4 10.54,3.12 16.33,1.8 19.43,7.44 20.55,6.86 22.66,6.53 22.68,5.33 22.58,3.91 22.58,2.51 22.53,1.14 26.42,1.17 30.33,0.84 33.6,0.81 33.53,3 35.03,2.08 30.28,2.9 32.31,2.03 14.4,9.91 17.98,11.38 19.51,8.81 21.23,7.98 20.78,9.3 27.25,4.27 27.18,5.69 30.84,5.28 32.23,5.26 34.16,5.23 36.25,5.26 38.05,11.76 43.48,25.53 44.96,20.88 46.3,29.69 47.29,30.23 48.59,30.76 48.56,35.79 48.54,38 13.74,37.62 47.24,38.91 46.25,38.05 46.18,35.89 46.23,39.95 31.78,42.85 42.34,42.95 42.06,41.27 44.3,42.29 20.65,42.55 25.88,46.76 84.3,0.99 86.41,0.97 83.06,2.82 84.07,2.79 85.12,2.87 77.57,3.84 78.33,9.98 78.64,8.74 75.64,8.1 76.17,9.75 77.34,8.84 97.49,7.98 98.2,12.27 74.63,9.47 97.74,9.42 89.41,25.58 77.6,7.52 79.27,7.29 94.39,14.94 90.78,25.86 91.62,25.02 91.62,26.04 84.73,13 100.89,44.91 64.87,10.13 92.35,45.54 38.73,2.11 38.56,3.3 37.08,2.51 102.95,43.18 97.28,46.05 94.77,45.97 101.32,46.86 69.11,12.83 98.65,34.16 63.22,9.53 62.08,9.04 105.33,43.99 55.04,3.35 55.7,1.24 95.91,44.27 58.72,8.66 57.68,7.92 57.61,9.88 54.03,1.17 57.25,6.4 57.25,4.52 57.25,2.84 57.18,0.94 58.6,1.78 69.75,12.8 96.7,40.56 53.57,3.23 59.89,0.89 61.8,0.89 63.96,0.84 65.53,0.84 91.03,3.35 59.31,9.68 73.1,46.2 91.21,19.58 84.35,44.45 6.96,0.97 3.43,5.28 9.96,9.88 5.66,2.03 5.36,3.76 0.71,4.5 0.69,6.68 29.11,26.64 25.68,25.48 26.95,25.5 29.13,25.1 29.16,23.8 29.18,22.3 24.69,21.77 0.84,43.08 1.07,40.56 33.38,41.17 0.84,38.81 33.2,43.79 0.84,36.25 36.5,47.04 0.84,32.56 30.25,43.69 1.93,35.51 30.84,41.3 2.29,40.31 2.64,42.7 12.17,40.94 0.79,28.35 6.12,36.58 0.76,24.84 2.26,30.18 12.75,24.77 2.95,32.46 3.1,34.37 3.02,36.6 3.1,38.51 3.84,40.39 4.06,47.14 6.73,47.19 5.28,45.57 15.32,46.69 7.72,42.29 10.21,44.58 8.89,43.48 39.88,28.09 38.63,28.09 37.34,28.09 36.09,28.07 37.34,29.16 38.63,29.11 39.73,29.13 36.12,29.13 42.49,27.84 41.1,27.84 42.27,30.91 43.31,31.01 45.16,31.83 44.58,34.04 43.05,34.52 21.97,41.38 38.99,36.58 37.54,38.2 35.15,38.63 39.73,37.82 37.47,40.08 35.81,36.75 44.53,28.12 58.17,26.57 49.86,26.49 64.44,18.82 9.19,15.44 8.84,14.02 12.9,13.08 17.2,12.93 19.53,16.51 11.76,26.47 12.47,21.84 8.56,22.25 9.83,20.9 2.77,15.85 1.98,12.9 1.83,9.96 5.08,15.37 8.43,23.85 6.4,27.3 9.32,26.92 16.56,29.29 14.4,29.16 75.11,12.67 24.23,37.41 28.07,39.22 21.72,31.27 23.6,29.54 32.82,22.68 35.56,23.67 37.9,22.53 30.86,23.65 30.63,27.43 28.83,28.07 27.81,26.97 25.98,16 24.23,21.06 27.71,13.31 26.85,13.34 25.78,13.31 32.89,9.98 31.47,9.37 30.84,8.94 38.61,5.26 40.79,5.26 43.38,5.26 46.1,5.26 49,5.28 47.93,9.75 45.36,9.7 50.55,10.01 45.44,2.11 48.18,2.29 93.95,2.77 97.76,4.14 101.22,4.45 100.97,2.54 101.42,0.91 105.05,4.52 103.23,4.88 99.49,4.32 98.83,8 98.6,10.44 94.89,11.13 98.96,20.85 98.91,18.75 98.96,16.84 98.98,14.94 98.98,13.11 98.15,39.22 102.16,34.87 104.47,39.9 103.78,33.86 103.78,30.81 104.22,36.98 104.47,25.91 99.54,25.83 99.44,30.99 95.66,30.61 89.28,31.72 87.48,33.4 89.51,33.88 83.95,26.44 83.92,28.88 80.24,25.55 79.32,23.85 72.19,21.23 73.91,21.11 74.9,21.79 75.31,30.33 78.11,30.12 79.88,30.12 80.98,31.5 81.05,27.91 79.15,25.35 76.23,26.52 78.18,36.45 76.45,36.42 86.18,40.97 89.64,39.27 85.75,45.69 83.13,46.02 80.87,45.72 75.11,46.15 68.48,46.41 65.66,46.46 68.53,43.54 65.41,43.46 60.12,46.99 57.58,47.09 60.99,42.9 61.65,40.64 54.33,42.21 52.83,42.21 38.79,46.84 74.52,40.23 72.34,39.78 70.23,39.5 74.07,42.47 58.5,38.96 92.61,35.97 17.75,22.1 64.39,21.11 63.93,8.99 66.5,9.5 62,10.24 77.98,25.2 80.59,24.71 78.26,23.77 80.82,26.49 81.1,30.12 92.66,26.87 92.79,29.24 92.76,30.81 92.81,32.31 88.98,28.47 89,26.92 90.2,18.47 90.4,16.94 91.57,18.08 91.74,16.74 91.01,15.54 92.23,15.04
  pour Bottom (rank 6): -10,60 120,60 120,-10 -10,-10
  pour Top (rank 6): -11,61 121,61 121,-11 -11,-11
I2C_SCL  (via drill 0.3)  (1 unrouted)
  Top 0.254: U7.1 34.24,20.39 U1.25 v30.92,19.13 v30.91,19.13 | v7.39,7.29 6.78,7.9 6.78,17.7 v8.2,19.13 | v83.01,21.49 84.91,21.49 85.72,22.3 U2.11
  Bottom 0.254: v8.2,19.13 v30.91,19.13 30.99,19.2 39.5,19.2 40.16,18.54 42.82,18.54 43.89,17.48 73,17.48 77.01,21.49 v83.01,21.49 | I2C_HOST.1 7.34,7.34 v7.39,7.29
I2C_SDA  (via drill 0.3)  (1 unrouted)
  Top 0.254: U1.24 32.62,19.23 36.04,19.23 36.07,19.2 | v36.07,18.62 36.07,19.2 | 36.07,19.2 U7.2 | v7.39,9.35 7.39,17.4 v8.53,18.54 | v82.58,20.9 85.7,20.9 87,22.2 U2.10
  Bottom 0.254: v8.53,18.54 35.99,18.54 v36.07,18.62 39.29,18.62 39.85,18.06 42.55,18.06 43.61,16.99 73.25,16.99 77.17,20.9 v82.58,20.9 | I2C_HOST.2 7.38,9.34 v7.39,9.35
IO0
  Top 0.305: BOOT.2 93.58,4.75 82.42,4.75 81.92,5.26 U2.27 80.99,5.88 79.05,3.94 Q5.3 77.69,2.87 R49.1
IO19  (via drill 0.3)
  Top 0.406: R45.2 v67.54,38.08 | U2.13 v83.19,24.36
  Bottom 0.406: v67.54,38.08 79.38,38.08 82.65,34.8 82.65,24.89 v83.19,24.36
IO20  (via drill 0.3)
  Top 0.406: R46.2 v66.5,38.08 | U2.14 v81.92,24.36
  Bottom 0.406: v66.5,38.08 67.16,37.41 78.89,37.41 81.92,34.39 v81.92,24.36
LIN  (via drill 0.3)
  Top 0.406: v53.77,18.54 53.77,11.66 54.28,11.15 54.28,6.66 v54.25,6.63 | R2.2 23.79,7.51 v23.77,6.63
  Bottom 0.406: v53.77,18.54 53.77,18.97 55.6,20.8 55.6,26.19 57.99,28.58 LINE_IN.LEFT/TIP | v54.25,6.63 v23.77,6.63
LINX
  Top 0.254: U1.47 23.05,13.96 22.76,13.66 22.76,9.41 C43.+
LOUT  (via drill 0.3)
  Top 0.406: U4.8 54.62,19.43 R22.1 55.19,19.19 v55.19,18.54
  Bottom 0.406: LINE_OUT.LEFT/TIP 59.82,40.87 59.82,29.16 57.07,26.42 57.07,20.42 v55.19,18.54
LOUT_2V  (via drill 0.3)
  Top 0.305: U4.10 51.28,21.97 50.98,21.67 50.98,19.2 51.54,18.64 v51.54,14.53 | R51.1 49.28,14.88 | 49.28,14.88 49.77,14.88 C50.2 | v49.2,14.53 49.2,14.81 49.28,14.88
  Bottom 0.254: v49.2,14.53 v51.54,14.53
LRC  (via drill 0.3)  (1 unrouted)
  Top 0.254: PCM5101.15 | v29.41,10.79 U1.9 29.42,14.71 30.66,15.95 U1.18 37.89,15.96 38.56,15.29 39.14,15.29 39.19,15.34 | v91.82,12.5 95.89,8.43 U2.38
  Bottom 0.254: v29.41,10.79 31.47,10.79 33.2,12.52 41.22,12.52 41.73,12.01 91.34,12.01 v91.82,12.5
MCLK  (via drill 0.3)  (1 unrouted)
  Top 0.254: U2.15 78.94,21.61 78.64,21.31 v78.64,17.4 | U1.20 28.97,16.95 v28.42,16.41
  Bottom 0.254: v28.42,16.41 30,14.78 41.22,14.83 42.6,13.46 52.15,13.46 52.83,14.15 75.39,14.15 v78.64,17.4
MIDI_IN  (via drill 0.3)
  Top 0.254: U2.23 79.05,11.46 78.21,11.46 77.78,11.46 v75.84,13.39
  Top 0.406: R35.2 5.51,25.09 U15.4 9.14,25.35 11.28,23.22 v11.28,12.09
  Bottom 0.254: v11.28,12.09 31.01,12.09 32.41,13.49 41.86,13.49 42.37,12.98 52.4,12.98 53.09,13.66 75.56,13.66 v75.84,13.39
MIDI_OUT
  Top 0.305: U2.22 R37.2
N$1
  Top 0.254: 23.39,19.1 23.54,18.95 U1.37
  Top 0.305: C1.1 23.39,19.1
N$2
  Top 0.254: R3.1 C4.2
N$3
  Top 0.254: U1.15 33.99,14.46 C4.1
N$4
  Top 0.406: 1-10VPP.1 26.52,2.03 24.79,3.76 24.79,8.13 | 24.79,8.13 24.79,9.1 C43.- | R2.1 24.74,8.08 24.79,8.13
N$5
  Top 0.406: 1-10VPP.2 27.13,3.3 26.29,4.14 26.29,7.87 | 26.29,7.87 26.29,9 C44.- | R1.1 26.34,7.92 26.29,7.87
N$6
  Top 0.254: C8.+ 19.21,14.59 C7.1 20.99,14.61 21.51,14.61 22.36,15.46 U1.44
N$7
  Top 0.254: U1.43 21.9,15.96 21.64,15.7 21.02,15.7 C17.2 19.96,15.71 C6.2
N$8
  Top 0.254: C6.1 18,15.72 R4.1
N$13  (via drill 0.3)
  Top 0.406: R7.2 v2.08,17.91 | v2.08,28.7 4.78,28.7 11.76,35.69 17.45,35.69 20.14,33 CV_IN2.LEFT/TIP
  Bottom 0.406: v2.08,28.7 v2.08,17.91
N$15  (2 unrouted)
N$16
  Top 0.406: 57.23,20.74 57.23,17.07 | 57.23,17.07 57.23,16.1 C31.2 58.96,15.85 D10.A | 57.23,17.07 58.04,16.26 58.04,16.2
  Top 0.61: 58.04,16.2 57.63,16.2 57.45,16.38
N$18
  Top 0.406: U4.3 C23.2 40.73,24.5 40.18,23.95 37.95,23.95 37.34,24.56 U7.8
N$19
  Top 0.406: R5.2 2.06,27.3 2.77,28.02 5.05,28.02 10.04,33 CV_IN1.LEFT/TIP
N$20  (via drill 0.3)
  Top 0.406: U7.7 v38.61,24.82 | U4.5 47.24,21.58 C24.2 44.36,21.57 v43.66,21.57
  Bottom 0.406: v38.61,24.82 41.86,21.57 v43.66,21.57
N$21  (2 unrouted)
  Top 0.61: D8.A 63.53,22.97 U6.1 65.5,24.91 L3.P$2 | 62.61,22.73 62.61,23.01 64.29,24.69 65.1,24.69 | 65.46,24.69 65.1,24.69 | 65.1,24.69 63.6,23.19 64.19,23.19 65.2,24.21 65.2,23.57 64.82,23.19
  Top 0.813: 63.07,22.24 D8.A
N$22
  Top 0.254: C42.+
  Top 0.61: U7.10 C42.+
N$23  (via drill 0.3)  (2 unrouted)
  Top 0.305: 76.14,31.67 R11.2 | 76.09,32.21 76.14,32.16 | v75.41,32.69 75.41,32.28 75.49,32.21
  Top 0.635: 76.14,32.16 76.14,31.67 | D4.C 75.49,32.21 76.09,32.21 | D3.C v61.39,32.74
  Top 0.813: 74.32,32.92 74.35,32.94 75.95,32.94 75.44,32.44 74.83,32.44 75.51,31.75 | 75.51,31.75 76,31.75 | 75.51,31.75 74.75,31.75
  Top 1.778: D5.A D3.C
  Bottom 0.635: v61.39,32.74 v75.41,32.69
N$24  (via drill 0.3)
  Top 0.305: U16.3
  Top 0.61: U16.1 78.04,27.8 | 78.04,27.8 78.36,27.48 v78.89,27.48 79.73,27.48 79.96,27.71 79.96,28.81 U16.3 | C106.1 77.24,27.81 | 77.24,27.81 78.03,27.81 78.04,27.8 | D5.C v62.81,25.33 v62.81,25.32 | 77.24,27.81 77.98,28.55
  Bottom 0.61: v62.81,25.32 76.73,25.32 v78.89,27.48
N$25
  pour Top: 70.36,23.98 70.36,22.07 72.16,22.07 72.16,23.98
N$26
  Top 0.61: U6.3 R18.1 65.49,18.87 65.49,18.73 | 65.49,18.73 C29.2 | R19.2 65.49,18.03 65.49,18.73
N$27  (1 unrouted)
N$28
  Top 0.406: U6.5 67.03,22.02 66.7,21.69 66.7,19.8 R16.2
N$29  (1 unrouted)
  Top 0.813: D10.C 59.11,20.02 C30.2 61.54,18.41 D9.A | 59.26,19.48 59.51,19.23 61.49,19.23
N$30  (1 unrouted)
N$31
  Top 0.305: R13.1 49.02,18.66 49.02,20.5 48.82,20.7 U4.6
  Top 0.406: U4.6 45.91,20.7 R10.2
N$33
  Top 0.305: R12.1 49.53,17.92 49.53,25.04 48.79,25.78 U4.2
  Top 0.406: U4.2 45.63,25.78 R27.2
N$34
  Top 0.305: R48.1 85.18,3.83 Q2.1
N$35
  Top 0.406: 1-10VPP.5 R30.2
N$36
  Top 0.406: 1-10VPP.6 R29.2
N$37
  Top 0.305: Q5.1 R9.1
N$38
  Top 0.305: USB.A5 68.2,39.83 R53.1
N$39
  Top 0.305: USB.B5 65.2,39.79 R52.1
N$40
  Top 0.254: 19.16,2.03 R25.2
  Top 0.406: 1-10VPP.8 19.16,2.03
N$41
  Top 0.406: 1-10VPP.7 R26.2
N$42  (via drill 0.3)
  Top 0.305: 69.39,41.76 USB.VBUS1
  Top 0.61: USB.VBUS2 64.5,40.86 v64.21,40.56 63.96,40.31 FB3.1 | v69.39,40.56 69.39,41.76
  Bottom 0.61: v64.21,40.56 v69.39,40.56
N$43  (1 unrouted)
N$44  (via drill 0.3)
  Top 0.254: 1-10VPP.3 v29.44,4.57
  Top 0.406: U4.9 54.57,20.7 R22.2 54.8,20.47 55.37,20.47 55.85,19.99 55.85,18.01 55.14,17.3 55.14,12.6 55.6,12.14 v55.6,4.57
  Bottom 0.406: v29.44,4.57 v55.6,4.57
N$45  (via drill 0.3)
  Top 0.305: U4.13 54.67,25.78 R28.2 54.83,25.91 v56.34,25.91
  Top 0.406: v54.48,18.54 54.48,12.09 54.94,11.63 54.94,5.97 v54.91,5.94 | 1-10VPP.4 28.5,5.94 v29.26,5.94
  Bottom 0.406: v54.48,18.54 54.48,18.75 56.34,20.6 v56.34,25.91 | v54.91,5.94 v29.26,5.94
N$46  (1 unrouted)
N$48
  Top 0.406: PCM5101.18 C41.2 | C41.2 | C41.2 C2.+
N$50
  Top 0.305: PCM5101.7 47.58,15.99 R50.2
N$51
  Top 0.254: C49.2 42.56,12.76 43.84,14.05 45.08,14.05 PCM5101.4
N$52
  Top 0.254: PCM5101.2 43.83,12.74 43.46,12.37 43.46,10.81 C49.1
N$55  (via drill 0.3)
  Top 0.406: MIDI_IN.LEFT/TIP 31.04,33 24.33,26.29 v24.31,26.29 | v21.64,26.29 17.55,26.29 D13.+ 17.42,25.47 U15.2
  Bottom 0.406: v21.64,26.29 v24.31,26.29
N$56
  Top 0.406: R36.1 22.26,25.51 28.04,31.29 MIDI_IN.RIGHT/RING
N$57
  Top 0.406: U15.1 17.42,22.93 D13.- 18.28,24.62 R36.2
N$58  (via drill 0.3)
  Top 0.406: R37.1 v77.8,12.72
  Bottom 0.406: MIDI_OUT.LEFT/TIP 35.99,44.68 36.88,45.57 39.7,45.57 40.74,44.53 44.58,44.53 45.87,45.82 50.6,45.82 52.17,44.25 55.55,44.25 57.15,45.85 59.54,45.85 60.71,44.68 75.01,44.68 84.96,34.72 84.96,14.76 82.93,12.72 v77.8,12.72
N$59  (via drill 0.3)
  Top 0.406: R38.1 v4.09,26.75
  Bottom 0.406: v4.09,26.75 4.09,37.06 12.45,45.41 17.75,45.41 18.9,44.27 22.43,44.27 23.9,45.74 27.28,45.74 28.04,44.98 MIDI_OUT.RIGHT/RING
N$75
  Top 0.305: SD1.1 88.51,37.24 R39.1
N$77
  Top 0.305: SD1.8 87.62,29.54 R43.1
OUTL
  Top 0.305: PCM5101.6 47.19,15.34 R51.2
RESET  (via drill 0.3)
  Top 0.305: R47.1 C36.2 95.89,25.34 U2.3 95.89,21.67 v95.89,12.7 | Q2.3 87.24,2.88 RST.2 88.23,2.88 v88.21,2.9
  Bottom 0.305: v88.21,2.9 95.89,10.57 v95.89,12.7
RIN  (via drill 0.3)
  Top 0.406: v56.95,30.28 54.23,32.99 v53.03,32.99 | v53.59,7.29 53.59,10.64 53.06,11.18 53.06,18.52 v53.03,18.54 | R1.2 27.29,7.3 v27.3,7.29
  Bottom 0.305: v53.03,32.99 v53.03,33
  Bottom 0.406: v53.03,33 LINE_IN.RIGHT/RING | v53.03,18.54 53.03,19.18 54.89,21.03 54.89,26.47 56.95,28.52 v56.95,30.28 | v53.59,7.29 v27.3,7.29
RINX
  Top 0.254: C44.+ 27.52,10.26 23.65,10.26 23.34,10.57 23.34,13.41 23.39,13.46 U1.48
ROUT
  Top 0.305: U4.14 54.57,27.05 R28.1
  Top 0.61: U4.14 50.65,27.05 50.19,27.51 50.19,29.72 52.12,31.65 52.12,34.47 50.04,36.55 LINE_OUT.RIGHT/RING
ROUT_2V
  Top 0.305: U4.12 51.31,24.51 50.04,23.24 50.04,15.99 C51.2 48.6,15.85 R50.1
RTS  (1 unrouted)
  Top 0.254: 83.69,1.88 83.67,1.91
  Top 0.305: R9.2 Q2.2 | HOST.3 67.08,0.81 82.56,0.81 83.16,0.81 83.69,1.35 83.69,1.88
RXD/IO44  (via drill 0.3)
  Top 0.305: HOST.7 70.46,2.52 75.44,2.52 76.38,3.45 v76.38,5.31 | v84.38,7.29 92.81,7.29 93.34,6.76 U2.36
  Bottom 0.305: v76.38,5.31 82.37,5.28 v84.38,7.29
SPDIFIN_SIGNAL  (via drill 0.3)
  Top 0.406: v41.58,31.9 39.6,29.92 35.15,29.92 34.09,30.99 30.05,30.99 24,24.94 24,24.93 C1.2
  Bottom 0.406: v41.58,31.9 42.68,33 SPDIF_IN.LEFT/TIP
SPDIFOUT_SIGNAL  (via drill 0.3)
  Top 0.305: 34.02,7.96 v34.01,7.95
  Top 0.406: R3.2 34.02,7.96 | v52.91,7.95 52.91,10.01 52.25,10.67 v52.25,18.54
  Bottom 0.406: v34.01,7.95 v52.91,7.95 | SPDIF_OUT.LEFT/TIP 46.99,41.35 48.69,39.65 50.75,39.65 51.64,40.54 55.75,40.54 57.23,39.06 57.23,35.61 55.98,34.37 55.98,28.52 54.23,26.77 54.23,21.34 52.25,19.36 v52.25,18.54 | SPDIF_OUT.LEFT/TIP
SPI0_CS0  (via drill 0.3)
  Top 0.305: SD1.2 88.48,36.14 R40.1 D12.1 | v86.26,17.8 U2.18 80.16,17.8 78.23,15.88 74.09,15.88 66.98,8.76 64.87,8.76 HOST.4 | D12.1 87.8,34.79 | v88.29,34.24 88.28,34.25 D12.1
  Bottom 0.305: v86.26,17.8 86.26,33.83 86.67,34.24 v88.29,34.24
SPI0_MISO  (via drill 0.3)
  Top 0.305: 88.04,30.64 v87.88,30.64 | v87.88,30.64 SD1.7 | v87.88,13.99 U2.21 75.18,13.99 HOST.8 | D12.6 87.88,32.36 v87.88,30.64 | R42.1 87.44,30.2 v87.88,30.64
  Bottom 0.305: v87.88,13.99 v87.88,30.64
SPI0_MOSI  (via drill 0.3)
  Top 0.305: D12.3 v85.65,34.25 85.12,34.25 R41.1 | v85.65,16.54 U2.19 79.96,16.54 78.69,15.27 74.4,15.27 66.29,7.16 HOST.6 | 90.97,35.03 SD1.3 90.79,34.85 v89.99,34.85
  Bottom 0.305: v85.65,16.54 v85.65,34.25 86.25,34.85 v89.99,34.85
SPI0_SCK  (via drill 0.3)
  Top 0.305: R44.1 87.05,31.41 87.05,31.83 | v89.99,32.82 SD1.5 | v69.24,9.25 74.62,14.63 79.07,14.63 79.7,15.27 U2.20 v87.1,15.27 | v71.88,9.25 70.89,8.26 HOST.10 | 87.05,31.83 D12.5 | v87.1,31.85 87.07,31.85 87.05,31.83
  Bottom 0.305: v69.24,9.25 v71.88,9.25 | v87.1,15.27 v87.1,31.85 88.06,32.82 v89.99,32.82
TXD/IO43  (via drill 0.3)
  Top 0.305: HOST.9 72.34,3.17 75.23,3.17 75.62,3.56 v75.62,6.27 | v83.19,7.44 83.87,8.13 93.4,8.13 94.62,6.91 U2.37
  Bottom 0.305: v75.62,6.27 82.02,6.27 v83.19,7.44
USB_D+
  Top 0.305: R46.1 66.2,39.83 USB.B6 66.2,42.68 66.42,42.9 67.03,42.9 67.2,42.73 USB.A6
USB_D-
  Top 0.254: 67.72,41.05 67.39,40.72 67.39,40.69 67.69,40.39
  Top 0.305: USB.B7 67.7,40.72 | 67.7,40.72 67.7,39.67 R45.1 | USB.A7 66.7,40.87 66.85,40.72 67.39,40.72 67.7,40.72
VNEG
  Top 0.305: PCM5101.5 46.31,14.69 C48.2
VPWR  (2 unrouted)
  Top 1.27: D2.C D14.C 66.75,35.28 66.04,34.57 66.04,33.66 | 66.04,32.11 66.04,30.76 | 66.04,30.76 L3.P$1 68.54,29.16 | D1.C 65.94,32.21 66.04,32.11 | 64.16,32.26 64.64,32.26 66.04,33.66 | 66.04,33.66 66.04,32.11 | 66.04,30.76 64.67,32.13
XTI  (1 unrouted)
  Top 0.254: U1.39 22.99,17.95 22.76,18.19 22.76,22.02 20.95,23.82 19.28,23.82 19.07,23.62 19.07,23.05
XTO
  Top 0.254: U1.40 22.73,17.45 22.23,17.96 22.23,18.96

## Text on the board
tPlace: + | + | + | + | + | + | + | + | + | +
bPlace: OUT1 | OUT | OUT | OUT | MIDIIN/ | SPDIFIN/ | LINEIN/ | CVIN/ | OUT2 | CVIN/ | AmyBoard | V1.0
Measures: Units: Inches | Units: Inches